# EAGLE design v0_3 (EAGLE 7.2.0)
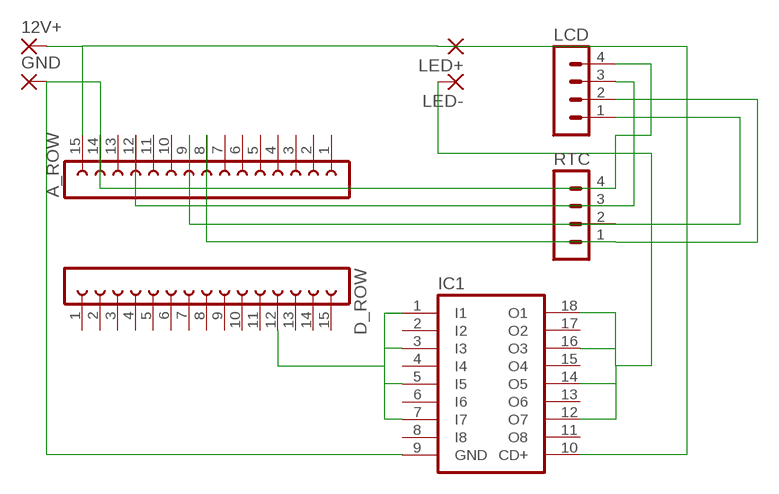
[diagram p0: schematic, sheet 1]

## Parts
12V+  3,17/1,3  [3,17/1,3]
A_ROW  FE15-1  [FE15]
D_ROW  FE15-1  [FE15]
GND  3,17/1,3  [3,17/1,3]
IC1  ULN2803A  [DIL18]
LCD  MA04-1  [MA04-1]
LED+  3,17/1,3  [3,17/1,3]
LED-  3,17/1,3  [3,17/1,3]
RTC  MA04-1  [MA04-1]

## Nets
N$1: 12V+.1(P) A_ROW.15 IC1.10(CD+) LED+.1(P)
N$2: A_ROW.14 GND.1(P) IC1.9(GND) LCD.4 RTC.4
N$3: IC1.12(O7) IC1.14(O5) IC1.16(O3) IC1.18(O1) LED-.1(P)
N$4: D_ROW.12 IC1.1(I1) IC1.3(I3) IC1.5(I5) IC1.7(I7)
N$6: A_ROW.12 LCD.3 RTC.3
N$7: A_ROW.8 LCD.2 RTC.1
N$8: A_ROW.9 LCD.1 RTC.2
Unconnected: A_ROW.1 A_ROW.2 A_ROW.3 A_ROW.4 A_ROW.5 A_ROW.6 A_ROW.7 A_ROW.10 A_ROW.11 A_ROW.13 D_ROW.1 D_ROW.2 D_ROW.3 D_ROW.4 D_ROW.5 D_ROW.6 D_ROW.7 D_ROW.8 D_ROW.9 D_ROW.10 D_ROW.11 D_ROW.13 D_ROW.14 D_ROW.15 IC1.2(I2) IC1.4(I4) IC1.6(I6) IC1.8(I8) IC1.11(O8) IC1.13(O6) IC1.15(O4) IC1.17(O2)

## Library data of the parts
12V+ GND LED+ LED- = wirepad:3,17/1,3: THROUGH-HOLE PAD
A_ROW D_ROW = con-lsta:FE15-1: FEMALE HEADER; OC_FARNELL: unknown; OC_NEWARK: unknown
IC1 = uln-udn:ULN2803A: DRIVER ARRAY
LCD RTC = con-lstb:MA04-1: PIN HEADER; OC_FARNELL: unknown; OC_NEWARK: unknown

## Board
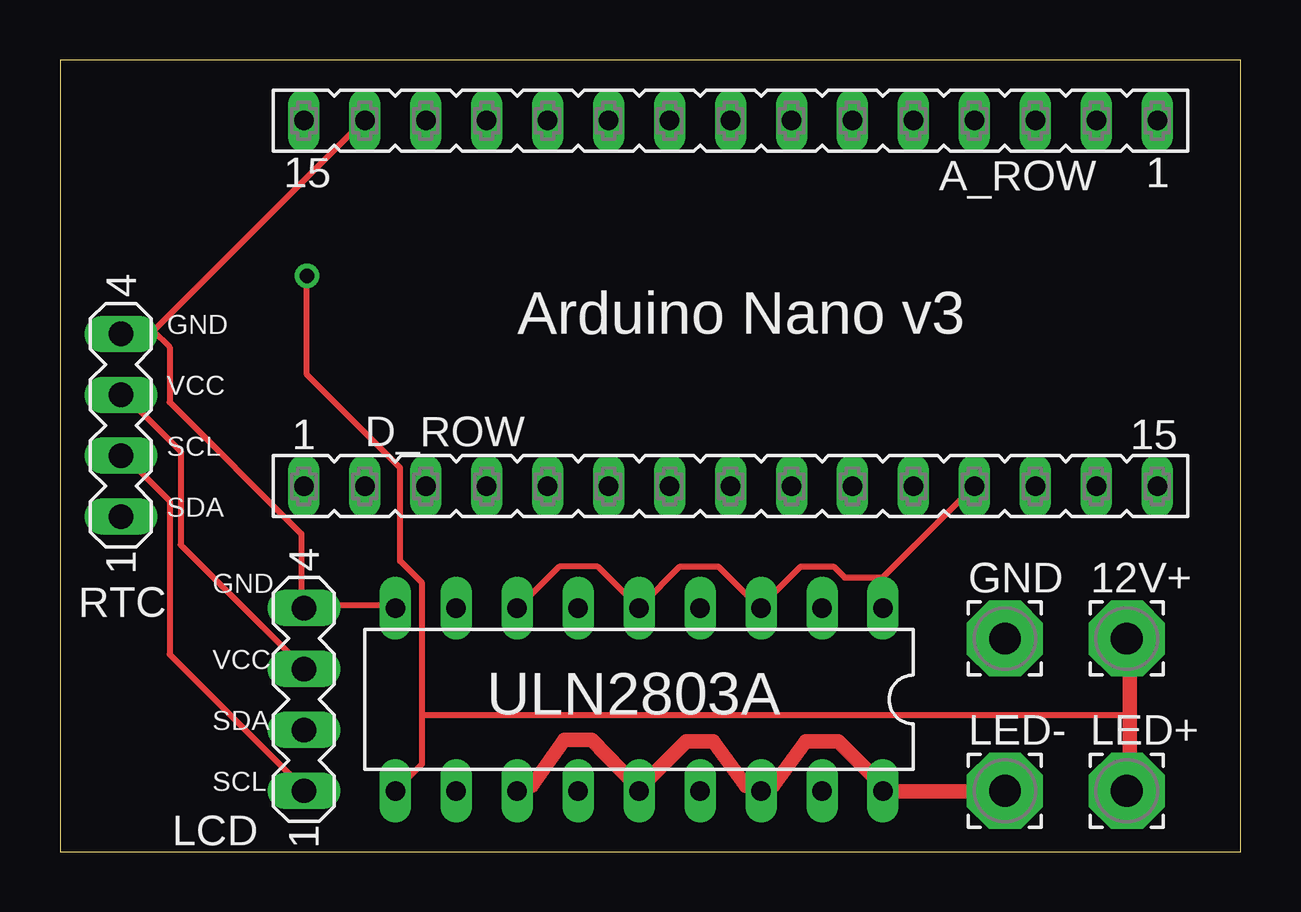
[diagram p1: board, top side]
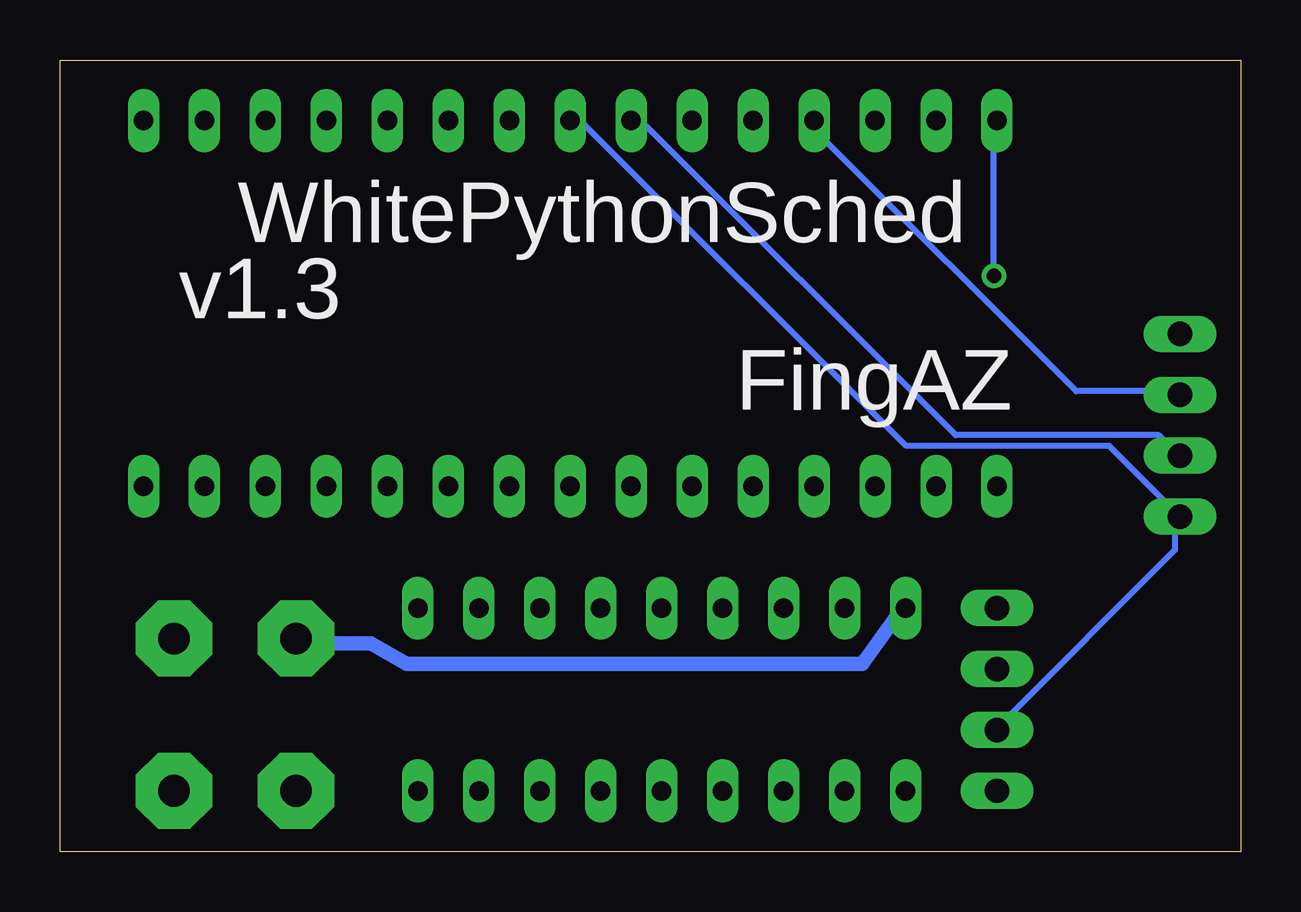
[diagram p2: board, bottom side, seen from below]

Size 49.2 x 33.01 mm. Coordinates in mm from the lower left corner, seen from the top.
Outline: 0,0 49.2,0 49.2,33.01 0,33.01 0,0
Copper layers (1*16): Top 0.035mm / dielectric 1.5mm / Bottom 0.035mm
Design rules "default": minimum track width 10mil, minimum drill 24mil, track to track 8mil, track to pad 8mil, pad to pad 8mil, via to via 8mil, smd to smd 8mil, copper to edge 40mil, drill to drill 8mil, minimum pad ring 10mil, minimum via ring 8mil, stop-mask expansion 4mil, vias tented up to drill 0mil, thermal gap 10mil

### Footprints (pad centres in the part's own frame; a part is rotated, then mirrored left to right if it is on the bottom)
3,17/1,3 = drill 1.321 pad 3.175 octagon: 1 0,0
FE15 = drill 0.813 long: 1 -17.78,0; 2 -15.24,0; 3 -12.7,0; 4 -10.16,0; 5 -7.62,0; 6 -5.08,0; 7 -2.54,0; 8 0,0; 9 2.54,0; 10 5.08,0; 11 7.62,0; 12 10.16,0; 13 12.7,0; 14 15.24,0; 15 17.78,0
DIL18 = drill 0.813 long: 1 -10.16,-3.81; 2 -7.62,-3.81; 3 -5.08,-3.81; 4 -2.54,-3.81; 5 0,-3.81; 6 2.54,-3.81; 7 5.08,-3.81; 8 7.62,-3.81; 9 10.16,-3.81; 10 10.16,3.81; 11 7.62,3.81; 12 5.08,3.81; 13 2.54,3.81; 14 0,3.81; 15 -2.54,3.81; 16 -5.08,3.81; 17 -7.62,3.81; 18 -10.16,3.81
MA04-1 = drill 1.016 long: 1 -3.81,0; 2 -1.27,0; 3 1.27,0; 4 3.81,0

### Placement (x,y rotation side)
12V+  44.45,8.89 0 top
A_ROW  27.94,30.48 180 top
D_ROW  27.94,15.24 0 top
GND  39.37,8.89 0 top
IC1  24.13,6.35 180 top
LCD  10.16,6.35 90 top
LED+  44.45,2.54 0 top
LED-  39.37,2.54 0 top
RTC  2.54,17.78 90 top

### Tracks (layer width: path | path; a pad name or v marks a point on that pad's centre or on a via)
N$1  (via drill 0.61)
  Top 0.254: 44.58,2.74 LED+.1 | 44.58,8.69 12V+.1 | v10.29,24 10.29,19.89 14.17,16 14.17,12.12 15.09,11.2 15.09,5.71 | 15.09,5.71 15.09,3.66 IC1.10 | 15.09,5.71 44.58,5.71
  Top 0.61: 44.58,8.69 44.58,5.71 44.58,2.74
  Bottom 0.254: v10.29,24 10.29,30.4 A_ROW.15
N$2
  Top 0.254: IC1.9 13.95,10.29 10.29,10.29 LCD.4 10.06,10.29 10.06,13.26 4.57,18.75 4.57,21.03 3.89,21.72 | 3.89,21.72 12.57,30.4 A_ROW.14 | 3.89,21.72 2.74,21.72 RTC.4 3.89,21.72
  Bottom 0.254: 39.32,8.69 GND.1 | 14.17,10.06 IC1.9
  Bottom 0.61: 39.32,8.69 36.25,8.69 34.75,7.82 15.77,7.82 14.17,10.06
N$3
  Top 0.254: 19.66,2.74 19.2,2.74 IC1.12 | 24,2.74 IC1.14 24.23,2.74 | 28.57,2.74 29.03,2.74 IC1.16 29.26,2.74 | 34.29,2.52 IC1.18 34.29,2.74 | 39.32,2.52 LED-.1
  Top 0.406: 29.72,2.74 29.26,2.74
  Top 0.61: 19.66,2.74 21.01,4.66 22.15,4.66 24,2.74 | 28.57,2.74 27.23,4.6 26.09,4.6 24.23,2.74 | 39.32,2.52 34.29,2.52 | 29.72,2.74 31.06,4.6 32.44,4.6 34.29,2.74
N$4
  Top 0.254: 34.29,11.43 IC1.1 34.29,10.29 | D_ROW.12 34.29,11.43 | IC1.7 19.2,10.29 20.8,11.89 22.4,11.89 IC1.5 24.23,10.29 25.83,11.89 27.43,11.89 29.03,10.29 IC1.3 29.26,10.29 30.86,11.89 32.23,11.89 32.69,11.43 34.29,11.43
N$6
  Top 0.254: LCD.3 10.06,7.77 5.03,12.8 5.03,16.69 2.74,18.97 RTC.3
  Bottom 0.254: A_ROW.12 17.6,30.4 17.6,29.95 6.86,19.2 2.74,19.2 RTC.3
N$7
  Bottom 0.254: A_ROW.8 27.89,30.4 27.43,30.4 13.95,16.92 5.49,16.92 RTC.1 2.74,13.95 2.74,12.57 10.06,5.26 LCD.2
N$8
  Top 0.254: LCD.1 10.06,2.74 4.57,8.23 4.57,14.63 2.74,16.46 RTC.2
  Bottom 0.254: A_ROW.9 25.38,30.4 24.92,30.4 11.89,17.37 3.43,17.37 2.74,16.69 RTC.2

### Text on the board
tNames: GND | Arduino Nano v3 | VCC | SCL | SDA | GND | VCC | ULN2803A | SDA | SCL
bNames: WhitePythonSched | v1.3 | FingAZ